# EAGLE schematic OLM-periph-probe+ambient-boostREVB (EAGLE 6.4)
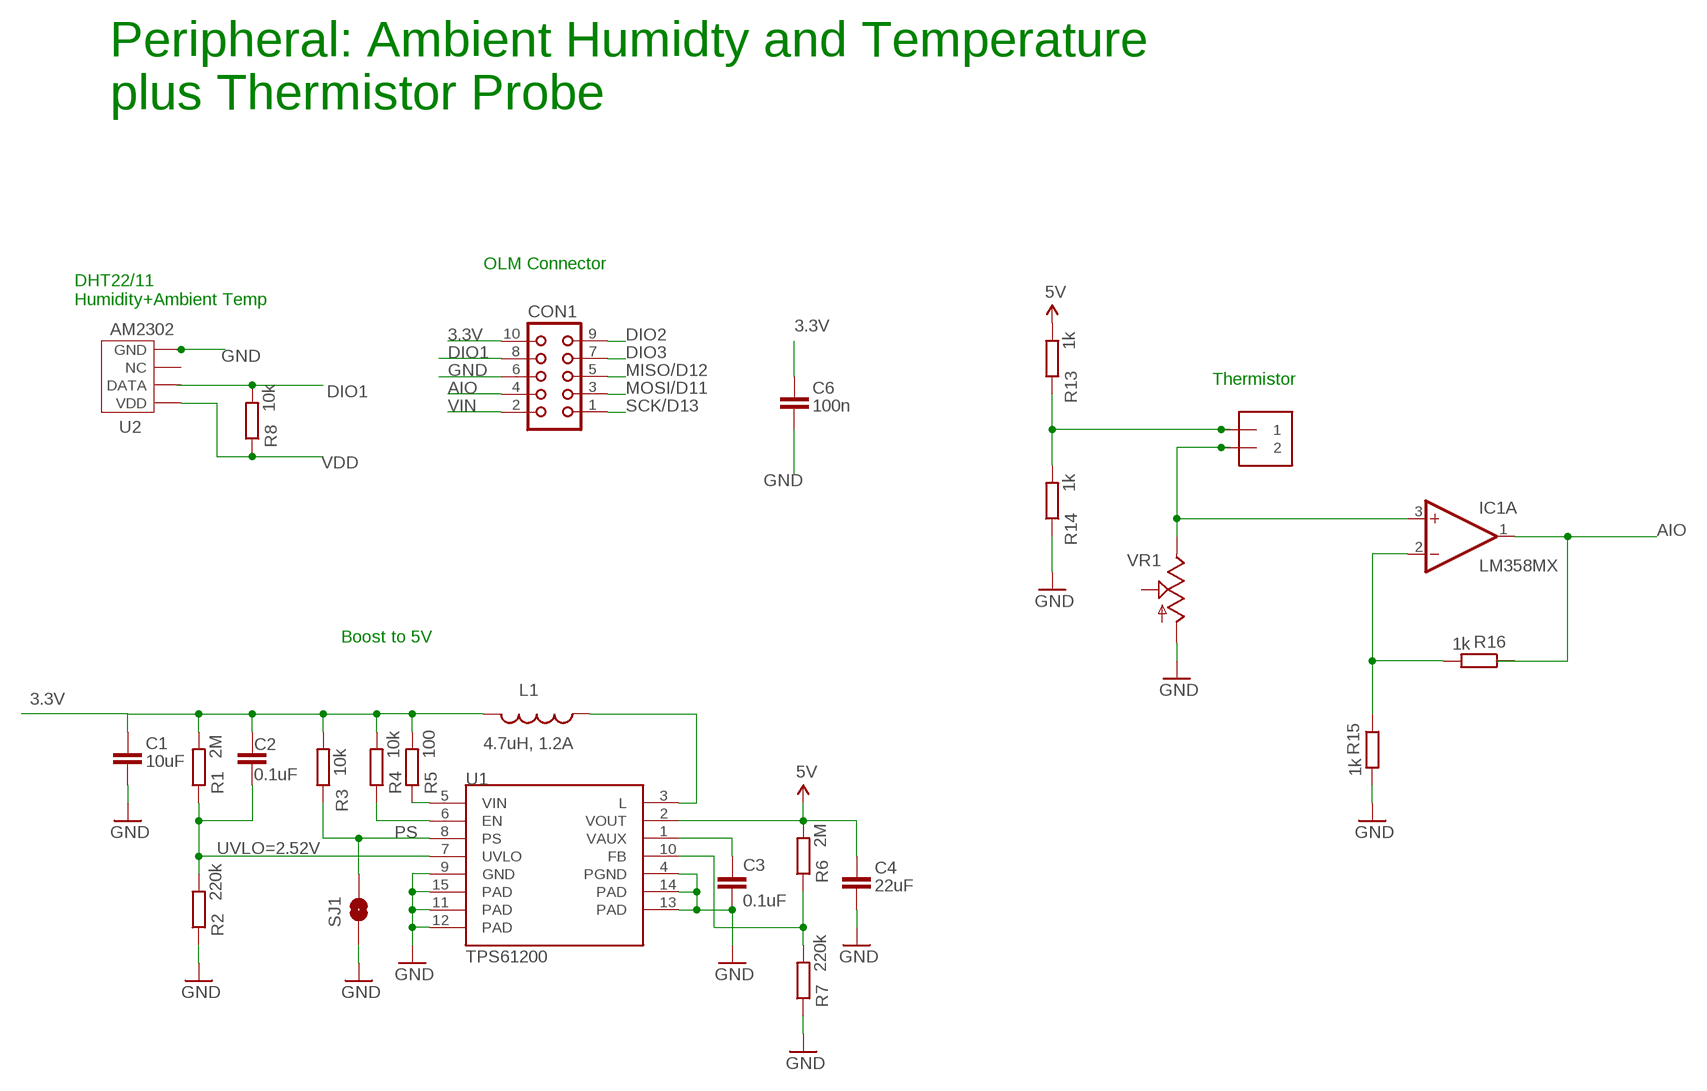
[diagram p0: schematic, sheet 1]

## Parts
C1  10uF  CAP1206  [1206]
C2  0.1uF  CAP0402-CAP  [0402-CAP]
C3  0.1uF  CAP0402-CAP  [0402-CAP]
C4  22uF  CAP0805  [0805]
C6  100n  CAP0805  [0805]
CON1  CON10L  [CON10L]
IC1  LM358MX  [SO08]
J1  1X2-3.5MM  [1X2-3.5MM]
L1  4.7uH, 1.2A  INDUCTOR.  [CDRH2D09]
R1  2M  R-EU_R0805  [R0805]
R2  220k  R-EU_R0805  [R0805]
R3  10k  R-EU_R0805  [R0805]
R4  10k  R-EU_R0805  [R0805]
R5  100  R-EU_R0805  [R0805]
R6  2M  R-EU_R0805  [R0805]
R7  220k  R-EU_R0805  [R0805]
R8  10k  R-EU_R0805  [R0805]
R13  1k  R-EU_R0805  [R0805]
R14  1k  R-EU_R0805  [R0805]
R15  1k  R-EU_R0805  [R0805]
R16  1k  R-EU_R0805  [R0805]
SJ1  PS  SOLDERJUMPERNO  [SJ_2S-NO]
U1  TPS61200  [QFN-10_PAD]
U2  AM2302  [AM2302]
VR1  10K  POT  [ALPS_POT]

## Nets
3.3V: C1.1 C2.1 C6.1 CON1.10 L1.P$2 R1.2 R3.2 R4.2 R5.2
5V: C4.1 R6.2 R13.2 U1.2(VOUT)
AIO: CON1.4 IC1.1(A:OUT) R16.1
DIO1: CON1.8 R8.2 U2.P$2(DATA)
DIO2: CON1.9
DIO3: CON1.7
EN1: R4.1 U1.6(EN)
FB1: R6.1 R7.2 U1.10(FB)
GND: C1.2 C3.2 C4.2 C6.2 CON1.6 R2.1 R7.1 R14.1 R15.2 SJ1.1 U1.4(PGND) U1.9(GND) U1.11(PAD) U1.12(PAD) U1.13(PAD) U1.14(PAD) U1.15(PAD) U2.P$4(GND) VR1.P$3(A)
MISO/D12: CON1.5
MOSI/D11: CON1.3
N$1: IC1.2(A:-IN) R15.1 R16.2
N$2: J1.1 R13.1 R14.2
N$3: IC1.3(A:+IN) J1.2 VR1.P$1(E)
N$4: L1.P$1 U1.3(L)
N$6: C3.1 U1.1(VAUX)
PS: R3.1 SJ1.2 U1.8(PS)
SCK/D13: CON1.1
UVLO1: C2.2 R1.1 R2.2 U1.7(UVLO)
VDD: R8.1 U2.P$1(VDD)
VIN: CON1.2
VIN-L: R5.1 U1.5(VIN)
Unconnected: IC1.5(B:+IN) IC1.6(B:-IN) IC1.7(B:OUT) U2.P$3(NC) VR1.P$2(S)

## Notes on the sheet
- Peripheral: Ambient Humidty and Temperature
  plus Thermistor Probe
- OLM Connector
- DHT22/11
  Humidity+Ambient Temp
- Thermistor
- Boost to 5V
- UVLO=2.52V

## Power pins joined to a net without a drawn wire
V+: IC1.8(P:V+)
V-: IC1.4(P:V-)

## Library data of the parts
C1 C4 C6 = CH_passive:CAP: Capacitor Standard 0603 ceramic capacitor, and 0.1" leaded capacitor.
C2 C3 = SparkFun:CAP: Capacitor Standard 0603 ceramic capacitor, and 0.1" leaded capacitor.
CON1 = con-harting:CON10L: CONNECTOR; OC_FARNELL: unknown; OC_NEWARK: unknown
IC1 = linear:LM358: OP AMP also LM158; LM258; LM2904 Source: http://cache.national.com/ds/LM/LM158.pdf
J1 = adafruit:1X2: 3.5mm Terminal block http://www.ladyada.net/library/pcb/eaglelibrary.html
L1 = SparkFun:INDUCTOR: Inductors Basic Inductor/Choke - 0603 and 1206. Footprints are not proven and vary greatly between part numbers.
R1-R8 R13-R16 = rcl:R-EU_: RESISTOR, European symbol
SJ1 = SparkFun:SOLDERJUMPER: Solder Jumper Standard SMD solder jumper. Used to automate production. Two varients : Normally Open and Normally Closed are the same, but have different paste layers. NC will have a large amount of paste and should jumper during reflow.
U1 = SparkFun:TPS61200: DC to DC Booster
U2 = sensor:AM2302
VR1 = SparkFun:POT

## Net classes
0 default: width 0.305 mm, clearance 0.203 mm
1 power: width 0.813 mm, drill 0.254 mm, clearance 0.254 mm